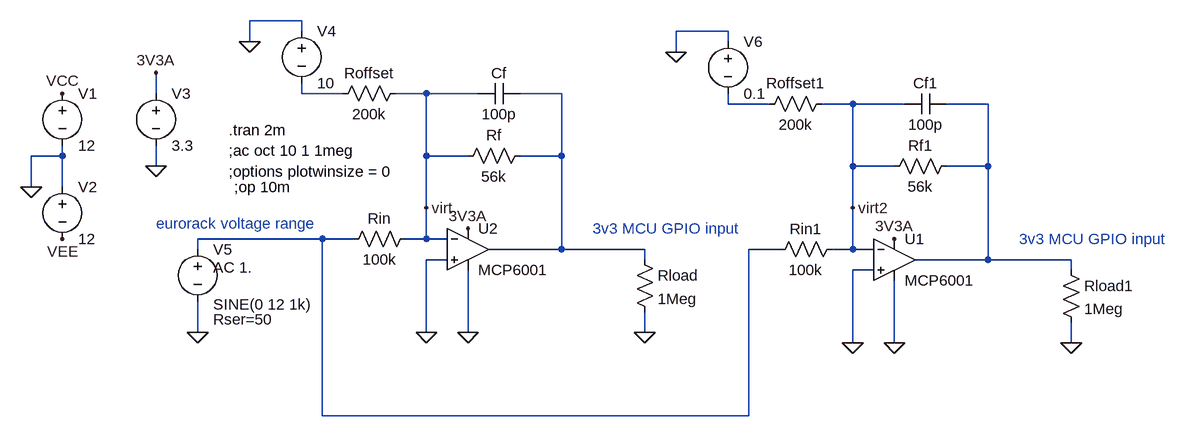
[diagram p0: schematic triggerIn.asc]
triggerIn.asc, the LTspice schematic file:
Version 4
SHEET 1 1296 680
WIRE -48 -160 -128 -160
WIRE -48 -144 -48 -160
WIRE 608 -144 528 -144
WIRE -128 -128 -128 -160
WIRE 608 -128 608 -144
WIRE 528 -112 528 -144
WIRE -272 -48 -272 -80
WIRE -48 -48 -48 -64
WIRE 16 -48 -48 -48
WIRE 144 -48 96 -48
WIRE 224 -48 144 -48
WIRE 352 -48 288 -48
WIRE 608 -32 608 -48
WIRE 672 -32 608 -32
WIRE 800 -32 752 -32
WIRE 880 -32 800 -32
WIRE 1008 -32 944 -32
WIRE -416 48 -416 32
WIRE -416 48 -464 48
WIRE 144 48 144 -48
WIRE 208 48 144 48
WIRE 352 48 352 -48
WIRE 352 48 288 48
WIRE -272 64 -272 32
WIRE 800 64 800 -32
WIRE 864 64 800 64
WIRE 1008 64 1008 -32
WIRE 1008 64 944 64
WIRE -464 96 -464 48
WIRE -416 96 -416 48
WIRE 144 128 144 48
WIRE 800 128 800 64
WIRE -16 176 -208 176
WIRE 32 176 -16 176
WIRE 144 176 144 128
WIRE 144 176 112 176
WIRE 176 176 144 176
WIRE -208 192 -208 176
WIRE 352 192 352 48
WIRE 352 192 240 192
WIRE 480 192 352 192
WIRE 688 192 640 192
WIRE 800 192 800 128
WIRE 800 192 768 192
WIRE 832 192 800 192
WIRE 176 208 144 208
WIRE 480 208 480 192
WIRE 1008 208 1008 64
WIRE 1008 208 896 208
WIRE 1136 208 1008 208
WIRE 832 224 800 224
WIRE 1136 224 1136 208
WIRE -208 320 -208 272
WIRE 144 320 144 208
WIRE 208 320 208 224
WIRE 480 320 480 288
WIRE 800 336 800 224
WIRE 864 336 864 240
WIRE 1136 336 1136 304
WIRE -16 448 -16 176
WIRE 640 448 640 192
WIRE 640 448 -16 448
FLAG 144 320 0
FLAG 480 320 0
FLAG -416 -48 VCC
FLAG -464 96 0
FLAG -416 176 VEE
FLAG -272 64 0
FLAG -272 -80 3V3A
FLAG 208 160 3V3A
FLAG -128 -128 0
FLAG -208 320 0
FLAG 208 320 0
FLAG 800 336 0
FLAG 1136 336 0
FLAG 864 176 3V3A
FLAG 864 336 0
FLAG 528 -112 0
FLAG 144 128 virt
FLAG 800 128 virt2
SYMBOL res 304 32 R90
WINDOW 0 0 56 VBottom 2
WINDOW 3 32 56 VTop 2
SYMATTR InstName Rf
SYMATTR Value 56k
SYMBOL res 112 -64 R90
WINDOW 0 0 56 VBottom 2
WINDOW 3 32 56 VTop 2
SYMATTR InstName Roffset
SYMATTR Value 200k
SYMBOL res 128 160 R90
WINDOW 0 0 56 VBottom 2
WINDOW 3 32 56 VTop 2
SYMATTR InstName Rin
SYMATTR Value 100k
SYMBOL cap 288 -64 R90
WINDOW 0 0 32 VBottom 2
WINDOW 3 32 32 VTop 2
SYMATTR InstName Cf
SYMATTR Value 100p
SYMBOL res 464 192 R0
SYMATTR InstName Rload
SYMATTR Value 1Meg
SYMBOL voltage -416 -64 R0
WINDOW 123 0 0 Left 0
WINDOW 39 0 0 Left 0
SYMATTR InstName V1
SYMATTR Value 12
SYMBOL voltage -416 80 R0
WINDOW 123 0 0 Left 0
WINDOW 39 0 0 Left 0
SYMATTR InstName V2
SYMATTR Value 12
SYMBOL ZZZ\\OpAmp\\MCP6001 208 128 R0
SYMATTR InstName U2
SYMBOL voltage -272 -64 R0
WINDOW 123 0 0 Left 0
WINDOW 39 0 0 Left 0
SYMATTR InstName V3
SYMATTR Value 3.3
SYMBOL voltage -48 -160 R0
WINDOW 123 0 0 Left 0
WINDOW 39 0 0 Left 0
SYMATTR InstName V4
SYMATTR Value 10
SYMBOL voltage -208 176 R0
WINDOW 3 24 101 Left 2
WINDOW 123 24 44 Left 2
WINDOW 39 24 124 Left 2
SYMATTR Value SINE(0 12 1k)
SYMATTR Value2 AC 1.
SYMATTR SpiceLine Rser=50
SYMATTR InstName V5
SYMBOL res 960 48 R90
WINDOW 0 0 56 VBottom 2
WINDOW 3 32 56 VTop 2
SYMATTR InstName Rf1
SYMATTR Value 56k
SYMBOL cap 944 -48 R90
WINDOW 0 0 32 VBottom 2
WINDOW 3 32 32 VTop 2
SYMATTR InstName Cf1
SYMATTR Value 100p
SYMBOL res 1120 208 R0
SYMATTR InstName Rload1
SYMATTR Value 1Meg
SYMBOL ZZZ\\OpAmp\\MCP6001 864 144 R0
SYMATTR InstName U1
SYMBOL res 784 176 R90
WINDOW 0 0 56 VBottom 2
WINDOW 3 32 56 VTop 2
SYMATTR InstName Rin1
SYMATTR Value 100k
SYMBOL res 768 -48 R90
WINDOW 0 0 56 VBottom 2
WINDOW 3 32 56 VTop 2
SYMATTR InstName Roffset1
SYMATTR Value 200k
SYMBOL voltage 608 -144 R0
WINDOW 123 0 0 Left 0
WINDOW 39 0 0 Left 0
SYMATTR InstName V6
SYMATTR Value 0.1
TEXT -160 8 Left 2 !.tran 2m
TEXT -160 72 Left 2 !;options plotwinsize = 0
TEXT -160 40 Left 2 !;ac oct 10 1 1meg
TEXT -272 152 Left 2 ;eurorack voltage range
TEXT 400 160 Left 2 ;3v3 MCU GPIO input
TEXT 1056 176 Left 2 ;3v3 MCU GPIO input
TEXT -152 96 Left 2 !;op 10m

The netlist it stands for:
* triggerIn.asc
Rf N002 virt 56k
Roffset virt N001 200k
Rin virt N005 100k
Cf N002 virt 100p
Rload N002 0 1Meg
V1 VCC 0 12
V2 0 VEE 12
* U2: MCP6001 (symbol ZZZ\OpAmp\MCP6001 not available, pins judged from their places): In+=0 In-=virt V+=3V3A V-=0 OUT=N002
V3 3V3A 0 3.3
V4 0 N001 10
V5 N005 0 SINE(0 12 1k) AC 1. Rser=50
Rf1 N004 virt2 56k
Cf1 N004 virt2 100p
Rload1 N004 0 1Meg
* U1: MCP6001 (symbol ZZZ\OpAmp\MCP6001 not available, pins judged from their places): In+=0 In-=virt2 V+=3V3A V-=0 OUT=N004
Rin1 virt2 N005 100k
Roffset1 virt2 N003 200k
V6 0 N003 0.1
.tran 2m
;options plotwinsize = 0
;ac oct 10 1 1meg
* eurorack voltage range
* 3v3 MCU GPIO input
* 3v3 MCU GPIO input
;op 10m
.backanno
.end